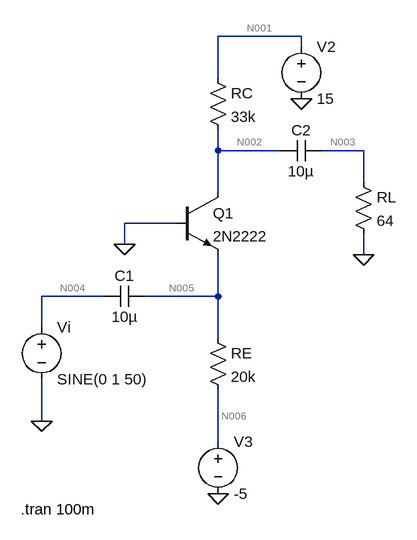
[diagram p0: schematic Draft3.asc]
Draft3.asc, the LTspice schematic file:
Version 4.1
SHEET 1 880 680
WIRE 384 -112 256 -112
WIRE 384 -96 384 -112
WIRE 256 -48 256 -112
WIRE 256 64 256 32
WIRE 352 64 256 64
WIRE 480 64 416 64
WIRE 480 112 480 64
WIRE 256 128 256 64
WIRE 192 176 112 176
WIRE 112 208 112 176
WIRE 480 224 480 192
WIRE 80 288 -16 288
WIRE 256 288 256 224
WIRE 256 288 144 288
WIRE -16 336 -16 288
WIRE 256 352 256 288
WIRE -16 480 -16 416
WIRE 256 512 256 432
FLAG 112 208 0
FLAG 480 224 0
FLAG 384 -16 0
FLAG 256 592 0
FLAG -16 480 0
SYMBOL npn 192 128 R0
SYMATTR InstName Q1
SYMATTR Value 2N2222
SYMBOL res 240 336 R0
SYMATTR InstName RE
SYMATTR Value 20k
SYMBOL voltage -16 320 R0
WINDOW 123 0 0 Left 0
WINDOW 39 0 0 Left 0
SYMATTR InstName Vi
SYMATTR Value SINE(0 1 50)
SYMBOL cap 144 272 R90
WINDOW 0 0 32 VBottom 2
WINDOW 3 32 32 VTop 2
SYMATTR InstName C1
SYMATTR Value 10µ
SYMBOL res 240 -64 R0
SYMATTR InstName RC
SYMATTR Value 33k
SYMBOL cap 416 48 R90
WINDOW 0 0 32 VBottom 2
WINDOW 3 32 32 VTop 2
SYMATTR InstName C2
SYMATTR Value 10µ
SYMBOL res 464 96 R0
SYMATTR InstName RL
SYMATTR Value 64
SYMBOL voltage 384 -112 R0
WINDOW 123 0 0 Left 0
WINDOW 39 0 0 Left 0
SYMATTR InstName V2
SYMATTR Value 15
SYMBOL voltage 256 496 R0
WINDOW 123 0 0 Left 0
WINDOW 39 0 0 Left 0
SYMATTR InstName V3
SYMATTR Value -5
TEXT -48 616 Left 2 !.tran 100m

The netlist it stands for:
* Draft3.asc
Q1 N002 0 N005 0 2N2222
RE N005 N006 20k
Vi N004 0 SINE(0 1 50)
C1 N005 N004 10µ
RC N001 N002 33k
C2 N003 N002 10µ
RL N003 0 64
V2 N001 0 15
V3 N006 0 -5
.model NPN NPN
.model PNP PNP
.lib standard.bjt
.tran 100m
.backanno
.end

* Results of the author's LTspice run, read from the files saved beside the schematic
* Operating Point, zero values left out:
*   V(n005) = -613.9 mV
*   V(n001) = 15 V
*   V(n002) = 7.796 V
*   V(n006) = -5 V
*   Ic(Q1) = 218.3 µA
*   Ib(Q1) = 1.013 µA
*   Ie(Q1) = -219.3 µA
*   I(RC) = 218.3 µA
*   I(V2) = -218.3 µA
*   I(RE) = 219.3 µA
*   I(V3) = 219.3 µA
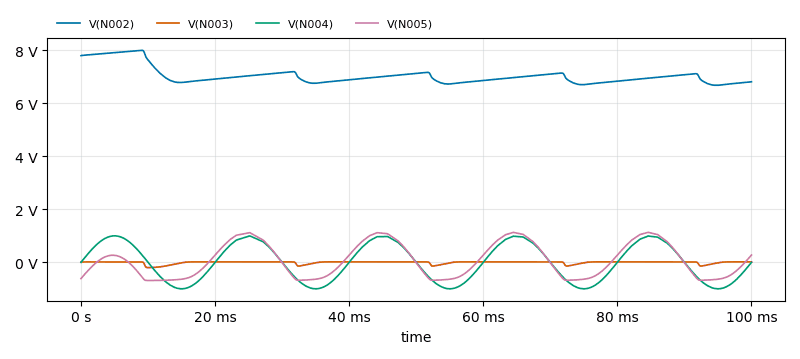
[diagram p1: Transient Analysis of Draft3.asc, plotted from the saved traces]
* Transient Analysis, 1 run:
*   V(N002): min 6.683 V, max 8.002 V, average 7.034 V, rms 7.041 V, last 6.816 V
*   V(N003): min -199.4 mV, max 16 mV, average -6.348 mV, rms 49.56 mV, last 15.87 mV
*   V(N004): min -1 V, max 999.6 mV, average -3.499 mV, rms 703.9 mV, last 0 V
*   V(N005): min -685.5 mV, max 1.132 V, average 75.63 mV, rms 640.1 mV, last 273.2 mV